# Altium schematic sheet MCU.SchDoc
size A4
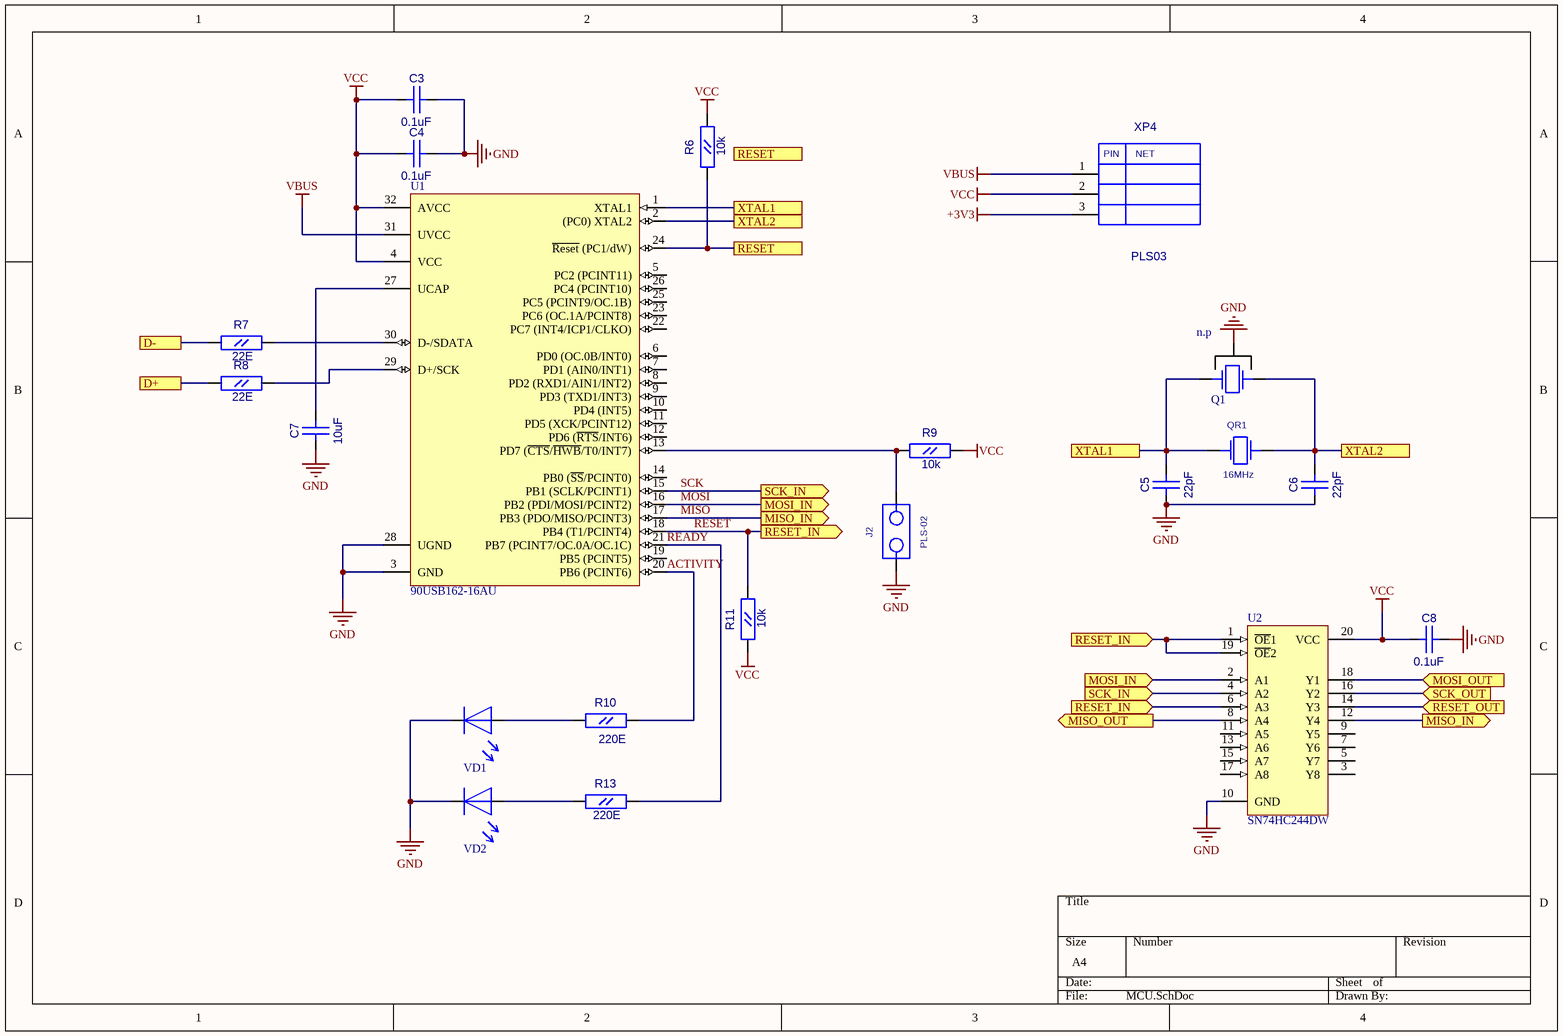
[diagram p0: MCU.SchDoc]

## Parts
C3  0.1uF  [CC0603]
C4  0.1uF  [CC0603]
C5  22pF  [CC0603]
C6  22pF  [CC0603]
C7  10uF  [CC0805]
C8  0.1uF  [CC0603]
J2  PLS-02  [PLS-02]
Q1  n.p  [AWSCR-16MHz]
QR1  16MHz  [AC5032_2]
R6  10k  [RC0603]
R7  22E  [RC0603]
R8  22E  [RC0603]
R9  10k  [RC0603]
R10  220E  [RC0603]
R11  10k  [RC0603]
R13  220E  [RC0603]
U1  90USB162-16AU  [32MA_N]
U2  SN74HC244DW  [DW020_N]
VD1  LED_0805  [LED0805]  (value not drawn)
VD2  LED_0805  [LED0805]  (value not drawn)
XP4  PLS03  [PLS-03]

## Ports
D+, D-, MISO_IN (out), MISO_OUT (out), MOSI_IN (in), MOSI_IN (out), MOSI_OUT (in), RESET, RESET_IN (in), RESET_IN (out), RESET_OUT (in), SCK_IN (in), SCK_IN (out), SCK_OUT (in), XTAL1, XTAL2

## Nets
+3V3: XP4.3
GND: C3.2(B) C4.2(B) C5.1(A) C6.1(A) C7.1(A) C8.2(B) J2.1 Q1.3 U1.3(GND) U1.28(UGND) U2.10(GND) VD1.2 VD2.2
VBUS: U1.31(UVCC) XP4.1
VCC: C3.1(A) C4.1(A) C8.1(A) R6.2(B) R9.2(B) R11.1(A) U1.4(VCC) U1.32(AVCC) U2.20(VCC) XP4.2
ACTIVITY: R10.2(B) U1.20(PB6_(PCINT6))
D+: R8.1(A) ; port D+
D-: R7.1(A) ; port D-
MISO: U1.17(PB3_(PDO/MISO/PCINT3)) U2.12(Y4) ; port MISO_IN
MISO_OUT: U2.8(A4) ; port MISO_OUT
MOSI: U1.16(PB2_(PDI/MOSI/PCINT2)) U2.2(A1) ; port MOSI_IN
MOSI_OUT: U2.18(Y1) ; port MOSI_OUT
READY: R13.2(B) U1.21(PB7_(PCINT7/OC.0A/OC.1C))
RESET: R11.2(B) U1.18(PB4_(T1/PCINT4)) U2.1(~{OE}1) U2.6(A3) U2.19(~{OE}2) ; port RESET_IN
RESET: R6.1(A) U1.24(~{Reset}_(PC1/dW)) ; port RESET  [a separate net that carries the same name]
RESET_OUT: U2.14(Y3) ; port RESET_OUT
SCK: U1.15(PB1_(SCLK/PCINT1)) U2.4(A2) ; port SCK_IN
SCK_OUT: U2.16(Y2) ; port SCK_OUT
XTAL1: C5.2(B) Q1.2 QR1.1 U1.1(XTAL1) ; port XTAL1
XTAL2: C6.2(B) Q1.1 QR1.2 U1.2((PC0)_XTAL2) ; port XTAL2
NetC7_2: C7.2(B) U1.27(UCAP)
NetJ2_2: J2.2 R9.1(A) U1.13(PD7_(~{CTS}/~{HWB}/T0/INT7))
NetR7_2: R7.2(B) U1.30(D-/SDATA)
NetR8_2: R8.2(B) U1.29(D+/SCK)
NetR10_1: R10.1(A) VD1.1
NetR13_1: R13.1(A) VD2.1

Not connected (* = marked no-connect by the designer): U1 5(PC2_(PCINT11)) 6(PD0_(OC.0B/INT0)) 7(PD1_(AIN0/INT1)) 8(PD2_(RXD1/AIN1/INT2)) 9(PD3_(TXD1/INT3)) 10(PD4_(INT5)) 11(PD5_(XCK/PCINT12)) 12(PD6_(~{RTS}/INT6)) 14(PB0_(~{SS}/PCINT0)) 19(PB5_(PCINT5)) 22(PC7_(INT4/ICP1/CLKO)) 23(PC6_(OC.1A/PCINT8)) 25(PC5_(PCINT9/OC.1B)) 26(PC4_(PCINT10)); U2 3(Y8) 5(Y7) 7(Y6) 9(Y5) 11(A5) 13(A6) 15(A7) 17(A8)

## Notes on the sheet
- (in symbol PLS03) PIN; NET

## Library data of the parts
C3-C6 C8 = CC0603
  C3 C4 C8: Value: 0.1uF
  C5 C6: Value: 22pF
C7 = CC0805: Value: 10uF
Q1 = Q_AWSCR-16MHz: Value: AWSCR-16MHz; n.p: n.p
QR1 = AC5032_2: AC5032/2; Value: 16MHz
R6-R11 R13 = RC0603
  R6 R9 R11: Value: 10k
  R7 R8: Value: 22E
  R10 R13: Value: 220E
U1 = 90USB162-16AU: 8-bit AVR Microcontroller, 2.7-5.5V, 16KB Flash, 512 Bytes EEPROM, 512 Bytes SRAM, USB Controller, 32-pin TQFP, Industrial Grade (-40°C to 85°C); Published: 1-Apr-2010; DatasheetVersion: revE, Nov-2008; PackageVersion: revB, Jul-2007; PackageReference: 32MA; Publisher: Altium Limited; PackageDescription: 32-Lead Thin Profile Plastic Quad Flatpack (TQFP) - 7x7x1mm Body,  0.8 mm Pitch; ComponentLink1Description: Manufacturer Link; ComponentLink1URL: http://www.atmel.com/products/avr/default.asp?; ComponentLink2Description: AT90USB82/162 Datasheet; ComponentLink2URL: http://www.atmel.com/dyn/resources/prod_documents/doc7707.pdf; ComponentLink3Description: AT90USB82/162 Summary; ComponentLink3URL: http://www.atmel.com/dyn/resources/prod_documents/7707S.pdf; ComponentLink4Description: Atmel.com Home; ComponentLink4URL: http://www.atmel.com
U2 = SN74HC244DW: Octal Buffer and Line Driver with 3-State Outputs; Published: 8-Jun-2000; LatestRevisionDate: 13-Apr-2006; LatestRevisionNote: IPC-7351 Footprint Added.; DatasheetVersion: May-1997; PackageVersion: Mar-2000; PackageReference: DW020; Publisher: Altium Limited; PackageDescription: 20-Pin Plastic Small Outline Integrated Circuit 1.27 mm Pitch; Code_JEDEC: MS-013; Code_IPC: SOIC127P1030-20; ComponentLink1Description: Manufacturer Link; ComponentLink1URL: http://www.ti.com/; ComponentLink2Description: Datasheet; ComponentLink2URL: http://www-s.ti.com/sc/ds/sn74hc244.pdf
J2 = PLS-02: Value: *
VD1 VD2 = LED_0805: Value: LED_0805
XP4 = PLS03: Value: *